# Altium schematic sheet Tui.SchDoc
size A2
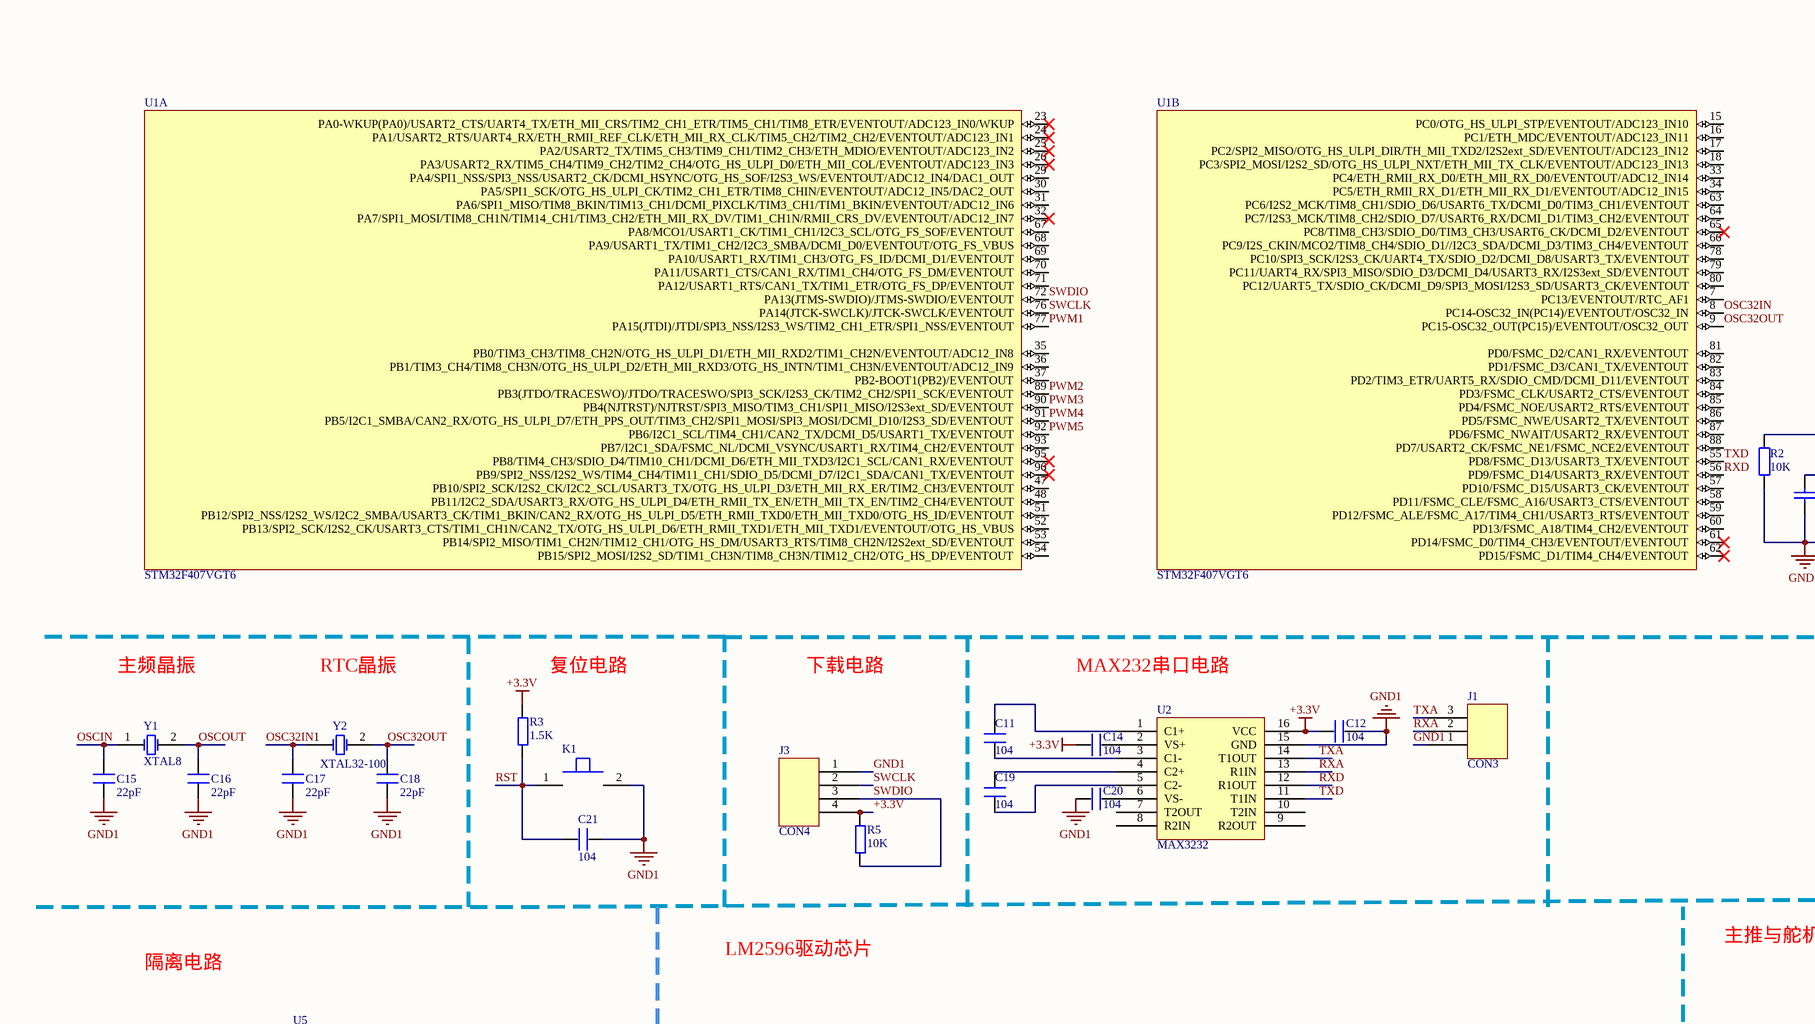
[diagram p0: Tui.SchDoc, top left]
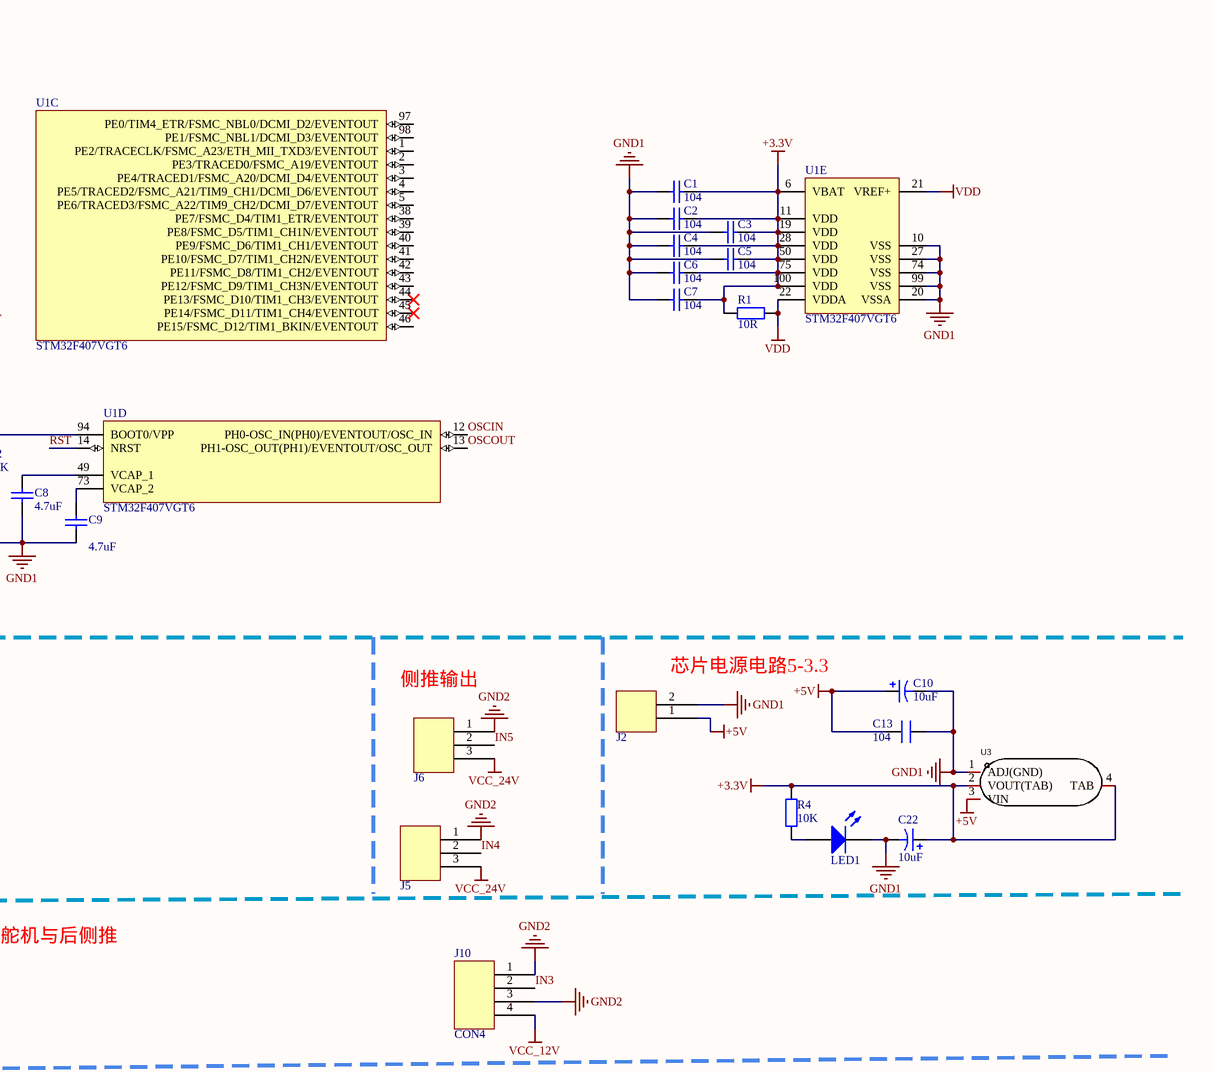
[diagram p1: Tui.SchDoc, top right]
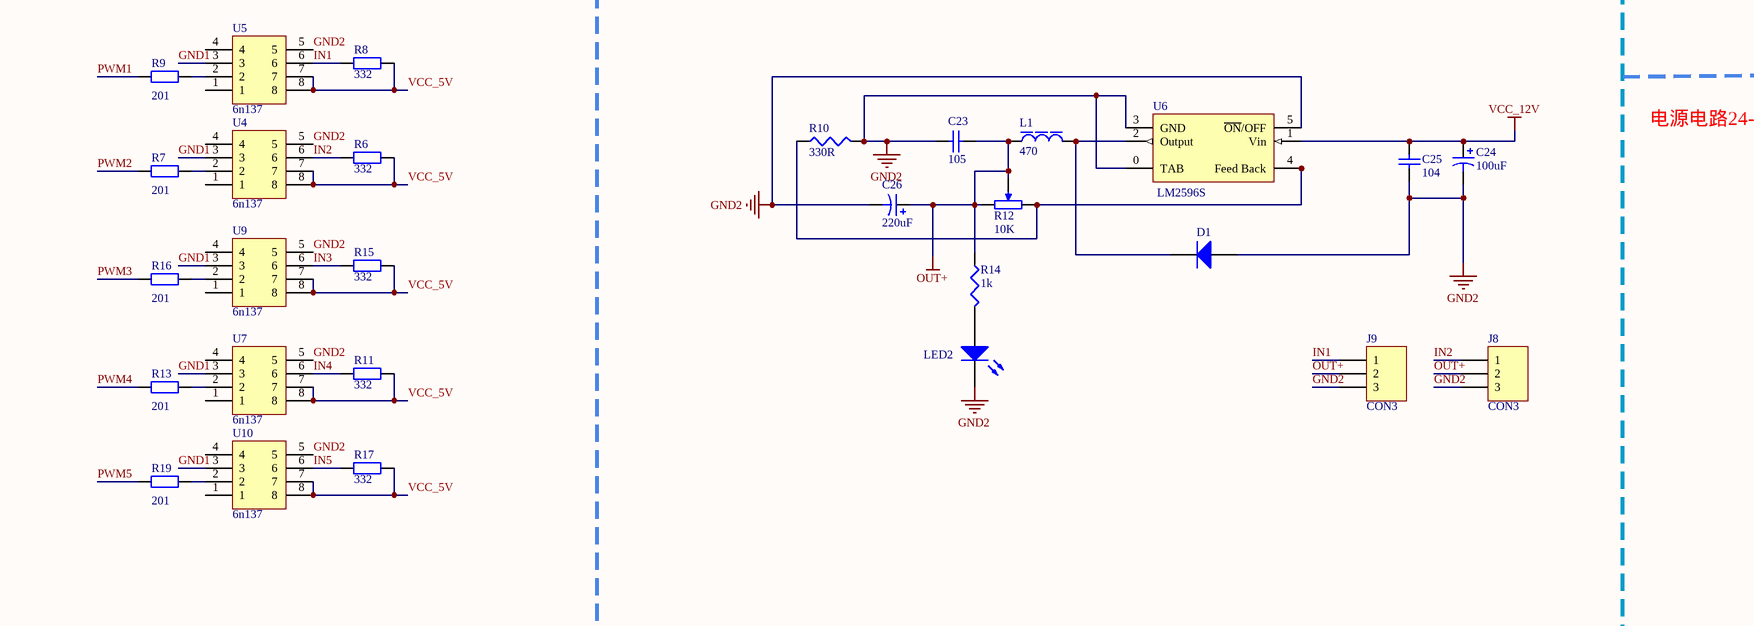
[diagram p2: Tui.SchDoc, bottom left]
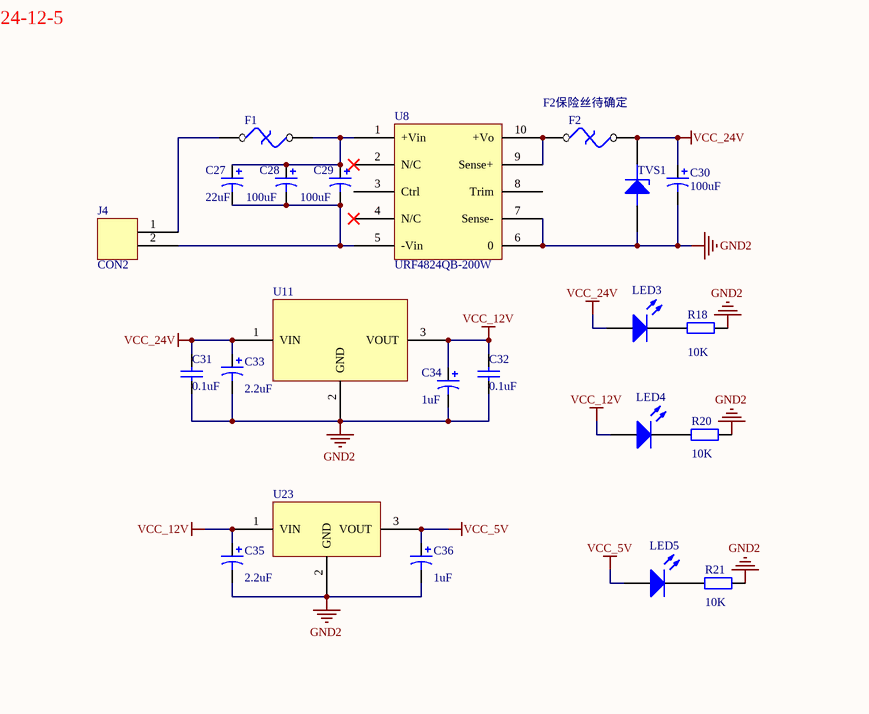
[diagram p3: Tui.SchDoc, bottom right]

## Parts
C1  104  [0805]
C2  104  [0805]
C3  104  [0805]
C4  104  [0805]
C5  104  [0805]
C6  104  [0805]
C7  104  [0805]
C8  4.7uF  [0805]
C9  4.7uF  [0805]
C10  value 10uF  [钽电容小]  (hidden comment: Cap Pol1)
C11  104  [0805]
C12  104  [0805]
C13  104  [0805]
C14  104  [0805]
C15  22pF  [0805]
C16  22pF  [0805]
C17  22pF  [0805]
C18  22pF  [0805]
C19  104  [0805]
C20  104  [0805]
C21  104  [0805]
C22  value 10uF  [钽电容小]  (hidden comment: Cap Pol1)
C23  105  [0805]
C24  value 100uF  [CAP+]  (hidden comment: 107T)
C25  104  [0805]
C26  value 220uF  [CAP+]  (hidden comment: 227V)
C27  value 22uF  [钽电容大]  (hidden comment: Cap Pol1)
C28  value 100uF  [钽电容大]  (hidden comment: Cap Pol1)
C29  value 100uF  [钽电容大]  (hidden comment: Cap Pol1)
C30  value 100uF  [钽电容大]  (hidden comment: Cap Pol1)
C31  0.1uF  [0805]
C32  0.1uF  [0805]
C33  value 2.2uF  [钽电容小]  (hidden comment: Cap Pol1)
C34  value 1uF  [钽电容小]  (hidden comment: Cap Pol1)
C35  value 2.2uF  [钽电容小]  (hidden comment: Cap Pol1)
C36  value 1uF  [钽电容小]  (hidden comment: Cap Pol1)
D1  DIODE  [SS34]  (value not drawn)
F1  THERMAL FUSE  [1206]  (value not drawn)
F2  THERMAL FUSE  [1206]  (value not drawn)
J1  CON3  [CON3BB]
J2  CON2  [CONN-TH_2P-P3.81_DB2EVC-3.81-2P-BK]  (value not drawn)
J3  CON4  [CON4]
J4  CON2  [CONN-TH_2P-P3.81_DB2EVC-3.81-2P-BK]
J5  CON3  [CONN-TH_3P-P3.81_DB2EVC-3.81-3P]  (value not drawn)
J6  CON3  [CONN-TH_3P-P3.81_DB2EVC-3.81-3P]  (value not drawn)
J8  CON3  [CONN-TH_3P-P3.81_DB2EVC-3.81-3P]
J9  CON3  [CONN-TH_3P-P3.81_DB2EVC-3.81-3P]
J10  CON4  [CONN-TH_4P-P3.81_DB2EVC-3.81-4P]
K1  KEY4  [按钮]  (value not drawn)
L1  470  [470]
LED1  LED  [0805]  (value not drawn)
LED2  (no value)  [0805]
LED3  LED  [0805]  (value not drawn)
LED4  LED  [0805]  (value not drawn)
LED5  LED  [0805]  (value not drawn)
R1  10R  [0805]
R2  10K  [0805]
R3  1.5K  [0805]
R4  10K  [0805]
R5  10K  [0805]
R6  332  [0805]
R7  201  [0805]
R8  332  [0805]
R9  201  [0805]
R10  330R  [0805]
R11  332  [0805]
R12  10K  [RESPACK]
R13  201  [0805]
R14  1k  [0805]
R15  332  [0805]
R16  201  [0805]
R17  332  [0805]
R18  value 10K  [0805]  (hidden comment: Res2)
R19  201  [0805]
R20  10K  [0805]
R21  10K  [0805]
TVS1  TVS  [tvs]  (value not drawn)
U1  STM32F407VGT6  [STM32F407VGT6]  (parts A,B,C,D,E of 5)
U2  MAX3232  [max3232]
U3  AMS1117-3.3_C347222  [AMS1117]  (value not drawn)
U4  6n137  [6n137]
U5  6n137  [6n137]
U6  LM2596S  [LM2596S]
U7  6n137  [6n137]
U8  URF4824QB-200W  [URF4824QB-200W（24稳压）]
U9  6n137  [6n137]
U10  6n137  [6n137]
U11  7812  [7812]  (value not drawn)
U23  7805  [7805]  (value not drawn)
Y1  XTAL8  [XTAL8（晶振）]
Y2  XTAL32-100  [XTAL32-100（晶振）]

## Nets
+3.3V: C1.1 C2.1 C3.1 C4.1 C5.1 C6.1 C7.1 C12.1 C14.2 C22.1 J3.4 R1.2 R3.2 R4.2 R5.2 U1.6(VBAT) U1.11(VDD) U1.19(VDD) U1.28(VDD) U1.50(VDD) U1.75(VDD) U1.100(VDD) U2.16(VCC) U3.2(VOUT(TAB)) U3.4(TAB)
+5V: C10.1 C13.2 J2.1 U3.3(VIN)
GND1: C1.2 C2.2 C3.2 C4.2 C5.2 C6.2 C7.2 C8.1 C9.1 C10.2 C12.2 C13.1 C15.1 C16.1 C17.1 C18.1 C20.1 C21.2 C22.2 J1.1 J2.2 J3.1 K1.2 LED1.2(K) R2.2 U1.10(VSS) U1.20(VSSA) U1.27(VSS) U1.74(VSS) U1.99(VSS) U2.15(GND) U3.1(ADJ(GND)) U4.3 U5.3 U7.3 U9.3 U10.3
GND2: C23.1 C24.2 C25.1 C26.2 C30.2 C31.1 C32.1 C33.2 C34.2 C35.2 C36.2 D1.1(A) J5.1 J6.1 J8.3 J9.3 J10.1 J10.3 LED2.2(K) R10.2 R18.2 R20.2 R21.2 TVS1.1(A) U4.5 U5.5 U6.0(TAB) U6.3(GND) U6.5(~{ON}/OFF) U7.5 U8.6(0) U8.7(Sense-) U9.5 U10.5 U11.2(GND) U23.2(GND)
OUT+: C23.2 C26.1 J8.2 J9.2 L1.1 R12.2(BOT) R12.3(TAP) R14.1
VCC_5V: C36.1 LED5.1(A) R6.1 R8.1 R11.1 R15.1 R17.1 U4.7 U4.8 U5.7 U5.8 U7.7 U7.8 U9.7 U9.8 U10.7 U10.8 U23.3(VOUT)
VCC_12V: C24.1 C25.2 C32.2 C34.1 C35.1 J10.4 LED4.1(A) U6.1(Vin) U11.3(VOUT) U23.1(VIN)
VCC_24V: C30.1 C31.2 C33.1 F2.2 J5.3 J6.3 LED3.1(A) TVS1.2(K) U11.1(VIN)
VDD: R1.1 U1.21(VREF+) U1.22(VDDA)
IN1: J9.1 R8.2 U5.6
IN2: J8.1 R6.2 U4.6
IN3: J10.2 R15.2 U9.6
IN4: J5.2 R11.2 U7.6
IN5: J6.2 R17.2 U10.6
OSC32IN: C17.2 U1.8(PC14-OSC32_IN(PC14)/EVENTOUT/OSC32_IN) Y2.1(OSC1)
OSC32OUT: C18.2 U1.9(PC15-OSC32_OUT(PC15)/EVENTOUT/OSC32_OUT) Y2.2(OSC2)
OSCIN: C15.2 U1.12(PH0-OSC_IN(PH0)/EVENTOUT/OSC_IN) Y1.1(OSC1)
OSCOUT: C16.2 U1.13(PH1-OSC_OUT(PH1)/EVENTOUT/OSC_OUT) Y1.2(OSC2)
PWM1: R9.1 U1.77(PA15(JTDI)/JTDI/SPI3_NSS/I2S3_WS/TIM2_CH1_ETR/SPI1_NSS/EVENTOUT)
PWM2: R7.1 U1.89(PB3(JTDO/TRACESWO)/JTDO/TRACESWO/SPI3_SCK/I2S3_CK/TIM2_CH2/SPI1_SCK/EVENTOUT)
PWM3: R16.1 U1.90(PB4(NJTRST)/NJTRST/SPI3_MISO/TIM3_CH1/SPI1_MISO/I2S3ext_SD/EVENTOUT)
PWM4: R13.1 U1.91(PB5/I2C1_SMBA/CAN2_RX/OTG_HS_ULPI_D7/ETH_PPS_OUT/TIM3_CH2/SPI1_MOSI/SPI3_MOSI/DCMI_D10/I2S3_SD/EVENTOUT)
PWM5: R19.1 U1.92(PB6/I2C1_SCL/TIM4_CH1/CAN2_TX/DCMI_D5/USART1_TX/EVENTOUT)
RST: C21.1 K1.1 R3.1 U1.14(NRST)
RXA: J1.2 U2.13(R1IN)
RXD: U1.56(PD9/FSMC_D14/USART3_RX/EVENTOUT) U2.12(R1OUT)
SWCLK: J3.2 U1.76(PA14(JTCK-SWCLK)/JTCK-SWCLK/EVENTOUT)
SWDIO: J3.3 R5.1 U1.72(PA13(JTMS-SWDIO)/JTMS-SWDIO/EVENTOUT)
TXA: J1.3 U2.14(T1OUT)
TXD: U1.55(PD8/FSMC_D13/USART3_TX/EVENTOUT) U2.11(T1IN)
NetC8_2: C8.2 U1.49(VCAP_1)
NetC9_2: C9.2 U1.73(VCAP_2)
NetC11_1: C11.1 U2.3(C1-)
NetC11_2: C11.2 U2.1(C1+)
NetC14_1: C14.1 U2.2(VS+)
NetC19_1: C19.1 U2.5(C2-)
NetC19_2: C19.2 U2.4(C2+)
NetC20_2: C20.2 U2.6(VS-)
NetC27_1: C27.1 C28.1 C29.1 F1.2 U8.1(+Vin)
NetC27_2: C27.2 C28.2 C29.2 J4.2 U8.5(-Vin)
NetD1_2: D1.2(K) L1.2 U6.2(Output)
NetF1_1: F1.1 J4.1
NetF2_1: F2.1 U8.9(Sense+) U8.10(+Vo)
NetLED1_1: LED1.1(A) R4.1
NetLED2_1: LED2.1(A) R14.2
NetLED3_2: LED3.2(K) R18.1
NetLED4_2: LED4.2(K) R20.1
NetLED5_2: LED5.2(K) R21.1
NetR2_1: R2.1 U1.94(BOOT0/VPP)
NetR7_2: R7.2 U4.2
NetR9_2: R9.2 U5.2
NetR10_1: R10.1 R12.1(TOP) U6.4(Feed_Back)
NetR13_2: R13.2 U7.2
NetR16_2: R16.2 U9.2
NetR19_2: R19.2 U10.2

Not connected (* = marked no-connect by the designer): U1 1(PE2/TRACECLK/FSMC_A23/ETH_MII_TXD3/EVENTOUT) 2(PE3/TRACED0/FSMC_A19/EVENTOUT) 3(PE4/TRACED1/FSMC_A20/DCMI_D4/EVENTOUT) 4(PE5/TRACED2/FSMC_A21/TIM9_CH1/DCMI_D6/EVENTOUT) 5(PE6/TRACED3/FSMC_A22/TIM9_CH2/DCMI_D7/EVENTOUT) 7(PC13/EVENTOUT/RTC_AF1) 15(PC0/OTG_HS_ULPI_STP/EVENTOUT/ADC123_IN10) 16(PC1/ETH_MDC/EVENTOUT/ADC123_IN11) 17(PC2/SPI2_MISO/OTG_HS_ULPI_DIR/TH_MII_TXD2/I2S2ext_SD/EVENTOUT/ADC123_IN12) 18(PC3/SPI2_MOSI/I2S2_SD/OTG_HS_ULPI_NXT/ETH_MII_TX_CLK/EVENTOUT/ADC123_IN13) 23(PA0-WKUP(PA0)/USART2_CTS/UART4_TX/ETH_MII_CRS/TIM2_CH1_ETR/TIM5_CH1/TIM8_ETR/EVENTOUT/ADC123_IN0/WKUP)* 24(PA1/USART2_RTS/UART4_RX/ETH_RMII_REF_CLK/ETH_MII_RX_CLK/TIM5_CH2/TIM2_CH2/EVENTOUT/ADC123_IN1)* 25(PA2/USART2_TX/TIM5_CH3/TIM9_CH1/TIM2_CH3/ETH_MDIO/EVENTOUT/ADC123_IN2)* 26(PA3/USART2_RX/TIM5_CH4/TIM9_CH2/TIM2_CH4/OTG_HS_ULPI_D0/ETH_MII_COL/EVENTOUT/ADC123_IN3)* 29(PA4/SPI1_NSS/SPI3_NSS/USART2_CK/DCMI_HSYNC/OTG_HS_SOF/I2S3_WS/EVENTOUT/ADC12_IN4/DAC1_OUT) 30(PA5/SPI1_SCK/OTG_HS_ULPI_CK/TIM2_CH1_ETR/TIM8_CHIN/EVENTOUT/ADC12_IN5/DAC2_OUT) 31(PA6/SPI1_MISO/TIM8_BKIN/TIM13_CH1/DCMI_PIXCLK/TIM3_CH1/TIM1_BKIN/EVENTOUT/ADC12_IN6) 32(PA7/SPI1_MOSI/TIM8_CH1N/TIM14_CH1/TIM3_CH2/ETH_MII_RX_DV/TIM1_CH1N/RMII_CRS_DV/EVENTOUT/ADC12_IN7)* 33(PC4/ETH_RMII_RX_D0/ETH_MII_RX_D0/EVENTOUT/ADC12_IN14) 34(PC5/ETH_RMII_RX_D1/ETH_MII_RX_D1/EVENTOUT/ADC12_IN15) 35(PB0/TIM3_CH3/TIM8_CH2N/OTG_HS_ULPI_D1/ETH_MII_RXD2/TIM1_CH2N/EVENTOUT/ADC12_IN8) 36(PB1/TIM3_CH4/TIM8_CH3N/OTG_HS_ULPI_D2/ETH_MII_RXD3/OTG_HS_INTN/TIM1_CH3N/EVENTOUT/ADC12_IN9) 37(PB2-BOOT1(PB2)/EVENTOUT) 38(PE7/FSMC_D4/TIM1_ETR/EVENTOUT) 39(PE8/FSMC_D5/TIM1_CH1N/EVENTOUT) 40(PE9/FSMC_D6/TIM1_CH1/EVENTOUT) 41(PE10/FSMC_D7/TIM1_CH2N/EVENTOUT) 42(PE11/FSMC_D8/TIM1_CH2/EVENTOUT) 43(PE12/FSMC_D9/TIM1_CH3N/EVENTOUT) 44(PE13/FSMC_D10/TIM1_CH3/EVENTOUT)* 45(PE14/FSMC_D11/TIM1_CH4/EVENTOUT)* 46(PE15/FSMC_D12/TIM1_BKIN/EVENTOUT) 47(PB10/SPI2_SCK/I2S2_CK/I2C2_SCL/USART3_TX/OTG_HS_ULPI_D3/ETH_MII_RX_ER/TIM2_CH3/EVENTOUT) 48(PB11/I2C2_SDA/USART3_RX/OTG_HS_ULPI_D4/ETH_RMII_TX_EN/ETH_MII_TX_EN/TIM2_CH4/EVENTOUT) 51(PB12/SPI2_NSS/I2S2_WS/I2C2_SMBA/USART3_CK/TIM1_BKIN/CAN2_RX/OTG_HS_ULPI_D5/ETH_RMII_TXD0/ETH_MII_TXD0/OTG_HS_ID/EVENTOUT) 52(PB13/SPI2_SCK/I2S2_CK/USART3_CTS/TIM1_CH1N/CAN2_TX/OTG_HS_ULPI_D6/ETH_RMII_TXD1/ETH_MII_TXD1/EVENTOUT/OTG_HS_VBUS) 53(PB14/SPI2_MISO/TIM1_CH2N/TIM12_CH1/OTG_HS_DM/USART3_RTS/TIM8_CH2N/I2S2ext_SD/EVENTOUT) 54(PB15/SPI2_MOSI/I2S2_SD/TIM1_CH3N/TIM8_CH3N/TIM12_CH2/OTG_HS_DP/EVENTOUT) 57(PD10/FSMC_D15/USART3_CK/EVENTOUT) 58(PD11/FSMC_CLE/FSMC_A16/USART3_CTS/EVENTOUT) 59(PD12/FSMC_ALE/FSMC_A17/TIM4_CH1/USART3_RTS/EVENTOUT) 60(PD13/FSMC_A18/TIM4_CH2/EVENTOUT) 61(PD14/FSMC_D0/TIM4_CH3/EVENTOUT/EVENTOUT)* 62(PD15/FSMC_D1/TIM4_CH4/EVENTOUT)* 63(PC6/I2S2_MCK/TIM8_CH1/SDIO_D6/USART6_TX/DCMI_D0/TIM3_CH1/EVENTOUT) 64(PC7/I2S3_MCK/TIM8_CH2/SDIO_D7/USART6_RX/DCMI_D1/TIM3_CH2/EVENTOUT) 65(PC8/TIM8_CH3/SDIO_D0/TIM3_CH3/USART6_CK/DCMI_D2/EVENTOUT)* 66(PC9/I2S_CKIN/MCO2/TIM8_CH4/SDIO_D1//I2C3_SDA/DCMI_D3/TIM3_CH4/EVENTOUT) 67(PA8/MCO1/USART1_CK/TIM1_CH1/I2C3_SCL/OTG_FS_SOF/EVENTOUT) 68(PA9/USART1_TX/TIM1_CH2/I2C3_SMBA/DCMI_D0/EVENTOUT/OTG_FS_VBUS) 69(PA10/USART1_RX/TIM1_CH3/OTG_FS_ID/DCMI_D1/EVENTOUT) 70(PA11/USART1_CTS/CAN1_RX/TIM1_CH4/OTG_FS_DM/EVENTOUT) 71(PA12/USART1_RTS/CAN1_TX/TIM1_ETR/OTG_FS_DP/EVENTOUT) 78(PC10/SPI3_SCK/I2S3_CK/UART4_TX/SDIO_D2/DCMI_D8/USART3_TX/EVENTOUT) 79(PC11/UART4_RX/SPI3_MISO/SDIO_D3/DCMI_D4/USART3_RX/I2S3ext_SD/EVENTOUT) 80(PC12/UART5_TX/SDIO_CK/DCMI_D9/SPI3_MOSI/I2S3_SD/USART3_CK/EVENTOUT) 81(PD0/FSMC_D2/CAN1_RX/EVENTOUT) 82(PD1/FSMC_D3/CAN1_TX/EVENTOUT) 83(PD2/TIM3_ETR/UART5_RX/SDIO_CMD/DCMI_D11/EVENTOUT) 84(PD3/FSMC_CLK/USART2_CTS/EVENTOUT) 85(PD4/FSMC_NOE/USART2_RTS/EVENTOUT) 86(PD5/FSMC_NWE/USART2_TX/EVENTOUT) 87(PD6/FSMC_NWAIT/USART2_RX/EVENTOUT) 88(PD7/USART2_CK/FSMC_NE1/FSMC_NCE2/EVENTOUT) 93(PB7/I2C1_SDA/FSMC_NL/DCMI_VSYNC/USART1_RX/TIM4_CH2/EVENTOUT) 95(PB8/TIM4_CH3/SDIO_D4/TIM10_CH1/DCMI_D6/ETH_MII_TXD3/I2C1_SCL/CAN1_RX/EVENTOUT)* 96(PB9/SPI2_NSS/I2S2_WS/TIM4_CH4/TIM11_CH1/SDIO_D5/DCMI_D7/I2C1_SDA/CAN1_TX/EVENTOUT)* 97(PE0/TIM4_ETR/FSMC_NBL0/DCMI_D2/EVENTOUT) 98(PE1/FSMC_NBL1/DCMI_D3/EVENTOUT); U2 7(T2OUT) 8(R2IN) 9(R2OUT) 10(T2IN); U4 1 4; U5 1 4; U7 1 4; U8 2(N/C)* 3(Ctrl) 4(N/C)* 8(Trim); U9 1 4; U10 1 4

## Notes on the sheet
- 主频晶振
- RTC晶振
- (near R3) 复位电路
- 下载电路
- MAX232串口电路
- (near J6) 侧推输出
- (near J2) 芯片电源电路5-3.3
- 隔离电路
- LM2596驱动芯片
- 主推与舵机与后侧推
- 电源电路24-12-5
- (near F2) F2保险丝待确定

## Library data of the parts
C1-C9 C31 C32 = Cap: Capacitor; Published: 8-Jun-2000; LatestRevisionDate: 17-Jul-2002; LatestRevisionNote: Re-released for DXP Platform.; PackageReference: RAD-0.3; Publisher: Altium Limited; PackageDescription: Radial Cap, Thru-Hole; 2 Leads; 0.3 in Pin Spacing
  C1-C7: Value: 104
  C8 C9: Value: 4.7uF
  C31 C32: Value: 0.1uF
C10 C22 C24 C26-C30 C33-C36 = Cap Pol1: Polarized Capacitor (Radial); Published: 8-Jun-2000; LatestRevisionDate: 17-Jul-2002; LatestRevisionNote: Re-released for DXP Platform.; PackageReference: RB7.6-15; Publisher: Altium Limited; PackageDescription: Polarized Capacitor (Radial); 2 Leads
C11-C21 = CAP
C23 = Cap Semi: Capacitor (Semiconductor SIM Model); 贴?: SMT; PackageReference: C0603; PackageDescription: Chip Capacitor; Value: 105
C25 = Cap Semi_1: Capacitor (Semiconductor SIM Model); 贴?: SMT; PackageReference: C0603; PackageDescription: Chip Capacitor; Value: 104
D1 = DI
J8 J9 = Header 3: Header, 3-Pin; LatestRevisionDate: 17-Jul-2002; LatestRevisionNote: Re-released for DXP Platform.; Publisher: Altium Limited
LED2 = LED2: Typical RED, GREEN, YELLOW, AMBER GaAs LED; 贴?: SMT; Value: LED_GREEN; PackageReference: 0603; PackageDescription: SM LED; 2 Flat Leads
R1 R2 R4 R6-R9 R11 R13 R15-R21 = Res2: Resistor; Published: 8-Jun-2000; LatestRevisionDate: 17-Jul-2002; LatestRevisionNote: Re-released for DXP Platform.; PackageReference: AXIAL-0.4; Publisher: Altium Limited; PackageDescription: Axial Device, Thru-Hole; 2 Leads; 0.4 in Pin Spacing
  R1: Value: 10R
  R2 R4 R20 R21: Value: 10K
  R6 R8 R11 R15 R17: Value: 332
R3 R5 = RES
R10 = Res3: Resistor; 贴?: SMT; PackageReference: R0603; PackageDescription: Chip Resistor; Value: 330R
R12 = RESP
R14 = RES: 贴?: SMT; Value: 1k; PackageDescription: R0603; PackageReference: R0603
TVS1 = 稳压二极管: Zener Diode
U1 = STM32F407VGT6: ARM Cortex-M4 32b MCU+FPU, 210DMIP, 1024 kB Flash, 192+4 kB RAM, Camera, 82 I/Os, 100-pin LQFP, -40 to +85癈, Tray; Internal RAM: 192kB; Operating Frequency (Processor Speed): 168MHz; A/D Converter: 16x12-bit; D/A Converter: 2x12-bit; 16-bit Timers (IC/OC/PWM): 12x16-bit(24/24/30); 32-bit Timer (IC/OC/PWM): 2x32-bit (8/8/8); Other Timer Functions: 2xWDG, RTC, 24-bit down counter; Serial Interface: 3xSPI/2xI2S/2xI2C/3xUSART(IrDa, ISO7816)/3xUART/2xUSB OTG FS/HS, 2xCAN/Ethernet MAC10/100, SDIO; DatasheetVersion: rev2, Jan-2012; PackageVersion: 2012; PackageReference: LQFP100; PackageDescription: 100-Pin Low Profile Quad Flat Package, 14x14 mm Body, 0.5 mm Pitch; ComponentLink1Description: Manufacturer URL; ComponentLink1URL: http://www.st.com/; ComponentLink2Description: STM32F405/7 Datasheet; ComponentLink2URL: http://www.st.com/internet/com/TECHNICAL_RESOURCES/TECHNICAL_LITERATURE/DATASHEET/DM00037051.pdf; ComponentLink3Description: STM32F4 Web Page; ComponentLink3URL: http://www.st.com/internet/mcu/subclass/1521.jsp
U3 = AMS1117-3.3_C347222: Manufacturer: UMW(广东友台半导体); Add into BOM: yes; Output Type: 固定; Output Polarity: 正; Number of Outputs: 1; Maximum Input Voltage: 18V; Output Voltage: 3.3V; Dropout Voltage: 1.3V@(1A); Output Current: 1A; Power Supply Rejection Ratio (PSRR): 60dB@(120Hz); Name: AMS1117-3.3; Symbol: AMS1117-3.3_C347222; Device: AMS1117-3.3_C347222; LCSC Part Name: AMS1117-3.3; Supplier Part: C347222; Manufacturer Part: AMS1117-3.3; Supplier Footprint: SOT-223; JLCPCB Part Class: Extended Part; Datasheet: https://atta.szlcsc.com/upload/public/pdf/source/20211011/50CC665C22E3A66C08379A4A74BDA25C.pdf; Supplier: LCSC; Convert to PCB: yes
U6 = LM25
U11 = L7912CV
LED1 LED3-LED5 = LED: Published: 8-Jun-2000; LatestRevisionDate: 17-Jul-2002; LatestRevisionNote: Re-released for DXP Platform.; PackageDocument: Feb-2002; PackageReference: 3.2X1.6X1.1; Publisher: Altium Limited
Y1 = XTAL8: Published: 8-Jun-2000; LatestRevisionDate: 17-Jul-2002; LatestRevisionNote: Re-released for DXP Platform.; Publisher: Altium Limited
Y2 = XTAL32-100: Published: 8-Jun-2000; LatestRevisionDate: 17-Jul-2002; LatestRevisionNote: Re-released for DXP Platform.; Publisher: Altium Limited